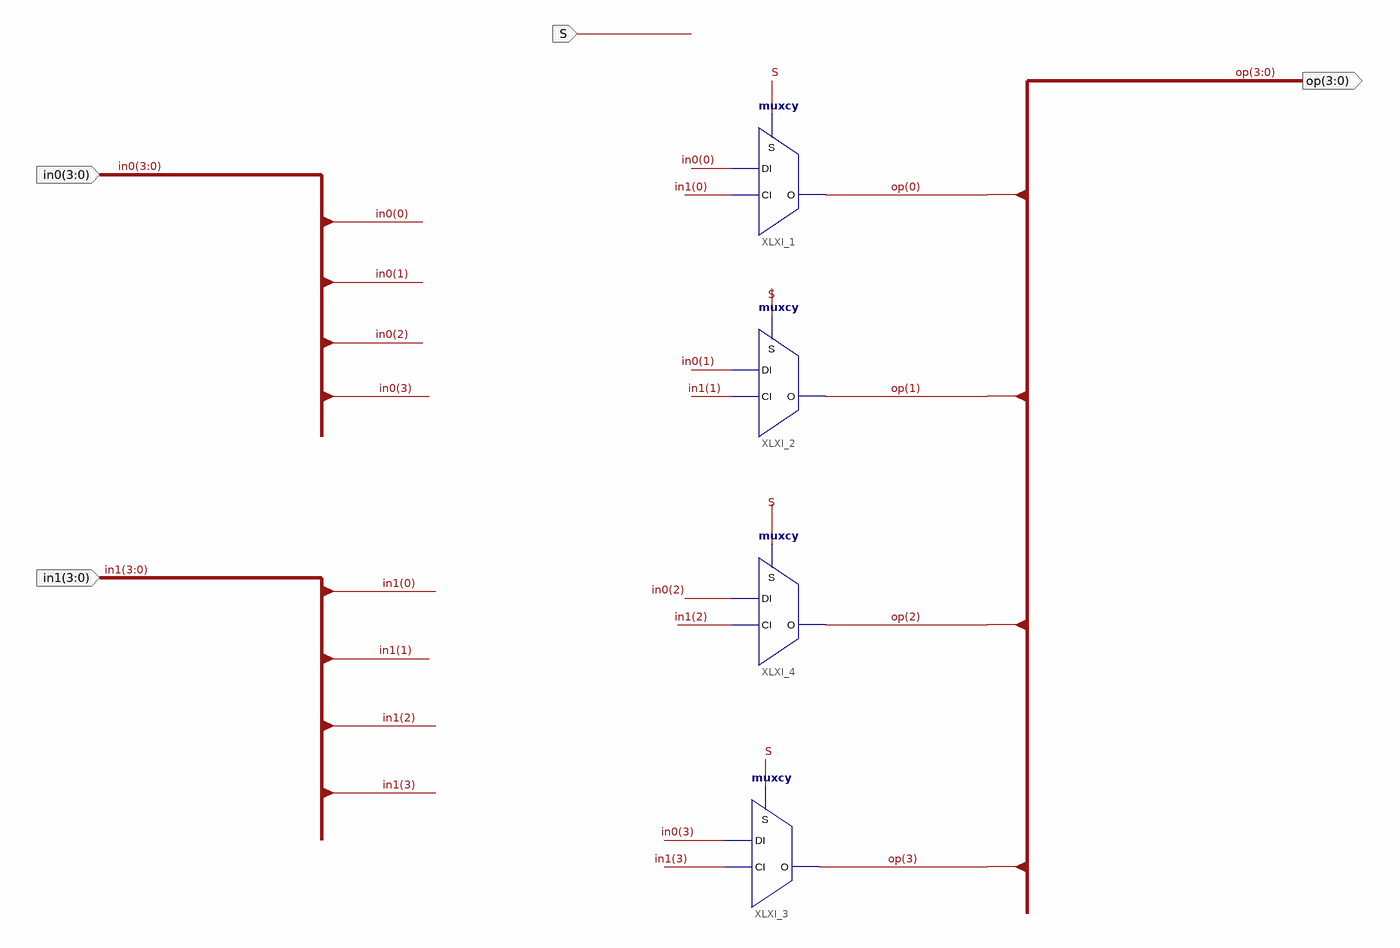
[diagram p0: schematic sheet 1]
// Xilinx ISE schematic mux_2_4bit.sch (spartan3e) as structural Verilog: 4 symbols, 4 ports
module mux_2_4bit (
  input  [3:0] in0,
  input  [3:0] in1,
  input  S,
  output [3:0] op
);

  muxcy XLXI_3 (.CI(in1[3]), .DI(in0[3]), .S(S), .O(op[3]));
  muxcy XLXI_4 (.CI(in1[2]), .DI(in0[2]), .S(S), .O(op[2]));
  muxcy XLXI_2 (.CI(in1[1]), .DI(in0[1]), .S(S), .O(op[1]));
  muxcy XLXI_1 (.CI(in1[0]), .DI(in0[0]), .S(S), .O(op[0]));
endmodule
